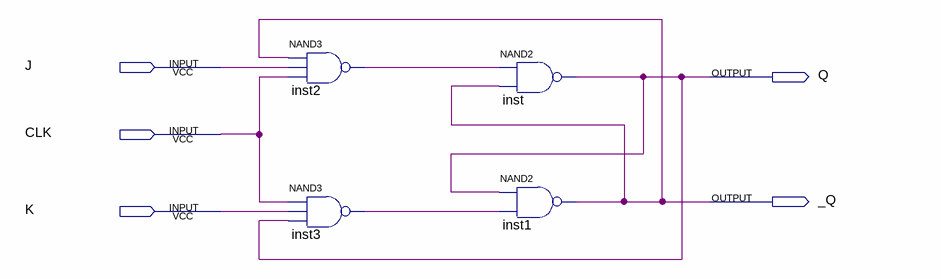
[diagram p0: schematic sheet]
// Quartus schematic ffjkclk.bdf as structural Verilog: 4 symbols, 5 pins
module ffjkclk (
  input  J,
  input  CLK,
  input  K,
  output Q,
  output _Q
);

  wire inst2_out, inst3_out;

  nand inst2 (inst2_out, _Q, J, CLK);
  nand inst3 (inst3_out, CLK, K, Q);
  nand inst (Q, inst2_out, _Q);
  nand inst1 (_Q, Q, inst3_out);
endmodule
